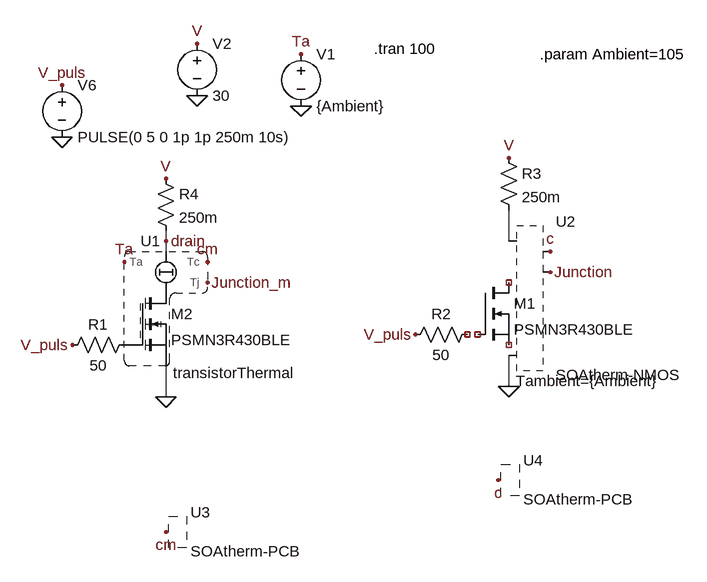
[diagram p0: schematic Test_Transistor.asc]
Test_Transistor.asc, the LTspice schematic file:
Version 4.1
SHEET 1 1836 1344
WIRE -272 80 -272 64
WIRE 256 80 256 32
WIRE -272 96 -272 80
WIRE 256 304 256 256
WIRE -272 320 -272 272
FLAG -64 -128 0
FLAG -64 -208 Ta
FLAG -272 320 0
FLAG 256 304 0
FLAG -336 112 Ta
FLAG 320 128 Junction
FLAG -208 144 Junction_m
FLAG -432 -80 0
FLAG -432 -160 V_puls
FLAG 112 224 V_puls
FLAG -416 240 V_puls
FLAG -224 -144 0
FLAG -272 528 cm
FLAG 240 448 c
FLAG -224 -224 V
FLAG -272 -16 V
FLAG 256 -48 V
FLAG -272 80 drain
FLAG -208 112 cm
FLAG 320 96 c
SYMBOL voltage -64 -224 R0
SYMATTR InstName V1
SYMATTR Value {Ambient}
SYMBOL res -320 224 R90
WINDOW 0 0 56 VBottom 2
WINDOW 3 32 56 VTop 2
SYMATTR InstName R1
SYMATTR Value 50
SYMBOL res 208 208 R90
WINDOW 0 0 56 VBottom 2
WINDOW 3 32 56 VTop 2
SYMATTR InstName R2
SYMATTR Value 50
SYMBOL SOAtherm-NMOS 256 192 R0
WINDOW 123 11 103 Left 2
SYMATTR Value2 Tambient={Ambient}
SYMATTR InstName U2
SYMATTR SpiceModel PSMN3R430BLE
SYMBOL nmos 208 144 R0
SYMATTR InstName M1
SYMATTR Value PSMN3R430BLE
SYMBOL nmos -320 160 R0
SYMATTR InstName M2
SYMATTR Value PSMN3R430BLE
SYMBOL transistorThermal -272 208 R0
SYMATTR InstName U1
SYMBOL voltage -432 -176 R0
WINDOW 123 0 0 Left 0
WINDOW 39 0 0 Left 0
SYMATTR InstName V6
SYMATTR Value PULSE(0 5 0 1p 1p 250m 10s)
SYMBOL SOAtherm-PCB -272 528 R0
SYMATTR InstName U3
SYMATTR Value2 Tambient={Ambient} LFM=100 PCB_FR4_Thickness_mm=1.5
SYMBOL SOAtherm-PCB 240 448 R0
SYMATTR InstName U4
SYMATTR Value2 Tambient={Ambient} LFM=100 PCB_FR4_Thickness_mm=1.5
SYMBOL voltage -224 -240 R0
SYMATTR InstName V2
SYMATTR Value 30
SYMBOL res 240 -64 R0
SYMATTR InstName R3
SYMATTR Value 250m
SYMBOL res -288 -32 R0
SYMATTR InstName R4
SYMATTR Value 250m
TEXT 48 -216 Left 2 !.tran 100
TEXT 304 -208 Left 2 !.param Ambient=105

The netlist it stands for:
* Test_Transistor.asc
V1 Ta 0 {Ambient}
R1 P001 V_puls 50
R2 NC_01 V_puls 50
* U2: PSMN3R430BLE Tambient={Ambient} (symbol SOAtherm-NMOS not available, pin order unknown); nets seen at it: 0, c, Junction, N001
M1 NC_02 NC_03 NC_04 NC_04 PSMN3R430BLE
M2 P002 P003 P004 P004 PSMN3R430BLE
X§U1 drain P001 0 P002 P003 P004 Junction_m cm Ta transistorThermal  ; pins D G S D2 G2 S2 Tj Tc Ta
V6 V_puls 0 PULSE(0 5 0 1p 1p 250m 10s)
* U3: Tambient={Ambient} LFM=100 PCB_FR4_Thickness_mm=1.5 (symbol SOAtherm-PCB not available, pin order unknown); nets seen at it: cm
* U4: Tambient={Ambient} LFM=100 PCB_FR4_Thickness_mm=1.5 (symbol SOAtherm-PCB not available, pin order unknown); nets seen at it: c
V2 V 0 30
R3 V N001 250m
R4 V drain 250m
.model NMOS NMOS
.model PMOS PMOS
.lib standard.mos
.tran 100
.param Ambient=105
.lib transistorThermal.lib
.backanno
.end